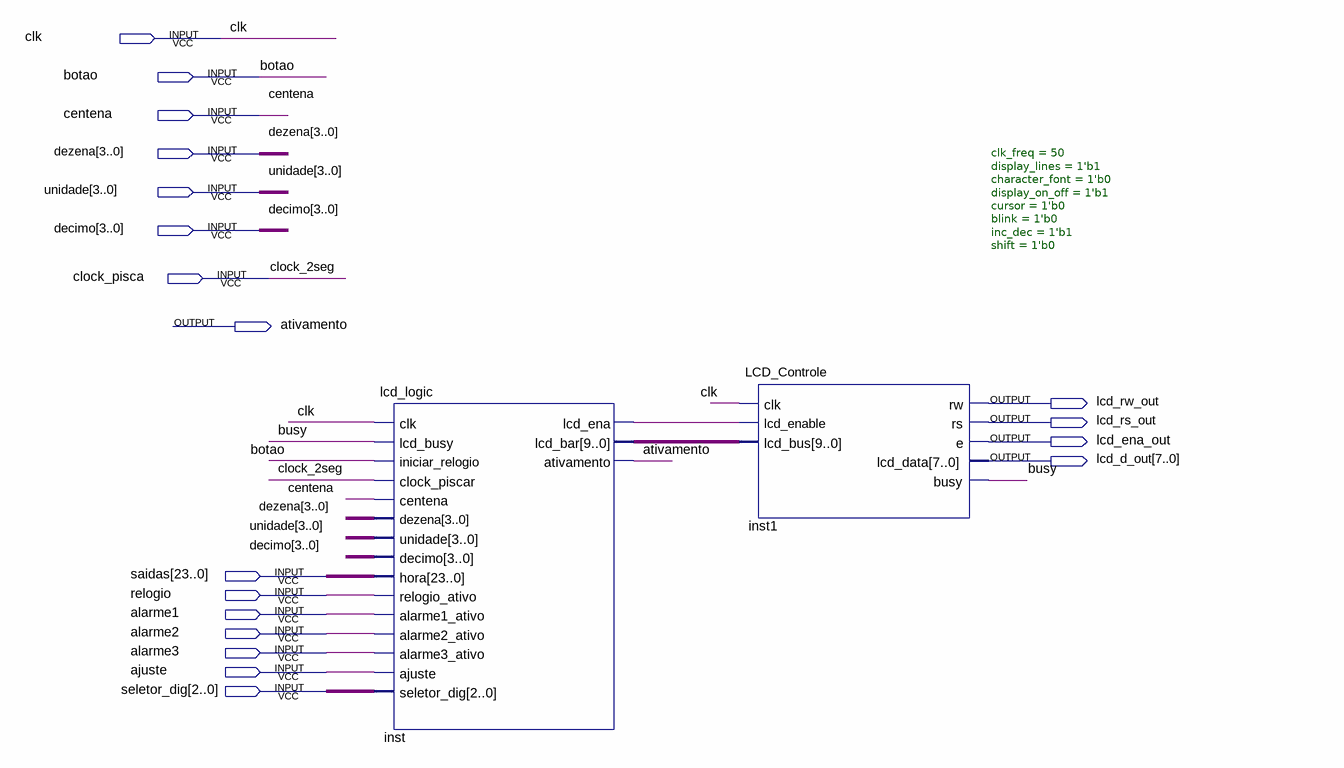
[diagram p0: schematic sheet]
// Quartus schematic lcd.bdf as structural Verilog: 2 symbols, 19 pins
module lcd (
  input  clk,
  input  botao,
  input  centena,
  input  [3:0] dezena,
  input  [3:0] unidade,
  input  [3:0] decimo,
  input  clock_pisca,
  input  [23:0] saidas,
  input  relogio,
  input  alarme1,
  input  alarme2,
  input  alarme3,
  input  ajuste,
  input  [2:0] seletor_dig,
  output ativamento,
  output lcd_rw_out,
  output lcd_rs_out,
  output lcd_ena_out,
  output [7:0] lcd_d_out
);

  wire busy, inst_lcd_ena;
  wire [9:0] inst_lcd_bar;

  lcd_logic inst (
    .clk(clk), .lcd_busy(busy), .iniciar_relogio(botao), .clock_piscar(clock_pisca), .centena(centena),
    .dezena(dezena), .unidade(unidade), .decimo(decimo), .hora(saidas), .relogio_ativo(relogio),
    .alarme1_ativo(alarme1), .alarme2_ativo(alarme2), .alarme3_ativo(alarme3), .ajuste(ajuste),
    .seletor_dig(seletor_dig), .lcd_ena(inst_lcd_ena), .lcd_bar(inst_lcd_bar), .ativamento(ativamento));
  LCD_Controle #(.clk_freq(50), .display_lines(1'b1), .character_font(1'b0), .display_on_off(1'b1), .cursor(1'b0), .blink(1'b0), .inc_dec(1'b1), .shift(1'b0)) inst1 (
    .clk(clk), .lcd_enable(inst_lcd_ena), .lcd_bus(inst_lcd_bar), .rw(lcd_rw_out), .rs(lcd_rs_out),
    .e(lcd_ena_out), .lcd_data(lcd_d_out), .busy(busy));

  // Other names for the same wires on the sheet: clock_2seg = clock_pisca
endmodule
